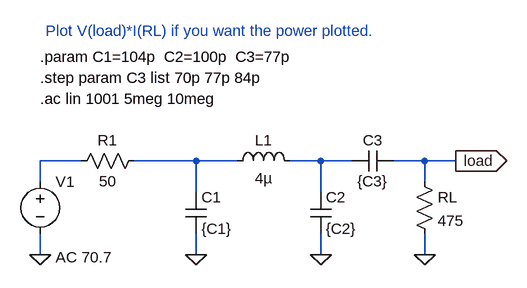
[diagram p0: schematic load_match.asc]
load_match.asc, the LTspice schematic file:
Version 4
SHEET 1 936 680
WIRE 0 112 -64 112
WIRE 176 112 80 112
WIRE 240 112 176 112
WIRE 368 112 320 112
WIRE 416 112 368 112
WIRE 528 112 480 112
WIRE 576 112 528 112
WIRE -64 144 -64 112
WIRE 528 144 528 112
WIRE 176 160 176 112
WIRE 368 160 368 112
WIRE -64 256 -64 224
WIRE 176 256 176 224
WIRE 368 256 368 224
WIRE 528 256 528 224
FLAG 176 256 0
FLAG -64 256 0
FLAG 528 256 0
FLAG 368 256 0
FLAG 576 112 load
IOPIN 576 112 Out
SYMBOL res -16 128 R270
WINDOW 0 32 56 VTop 0
WINDOW 3 0 56 VBottom 0
SYMATTR InstName R1
SYMATTR Value 50
SYMBOL cap 160 160 R0
SYMATTR InstName C1
SYMATTR Value {C1}
SYMBOL ind 224 128 R270
WINDOW 0 32 56 VTop 0
WINDOW 3 5 56 VBottom 0
SYMATTR InstName L1
SYMATTR Value 4µ
SYMBOL cap 416 128 R270
WINDOW 0 32 32 VTop 0
WINDOW 3 0 32 VBottom 0
SYMATTR InstName C3
SYMATTR Value {C3}
SYMBOL cap 352 160 R0
SYMATTR InstName C2
SYMATTR Value {C2}
SYMBOL res 512 128 R0
SYMATTR InstName RL
SYMATTR Value 475
SYMBOL voltage -64 128 R0
WINDOW 123 24 132 Left 0
WINDOW 39 0 0 Left 0
SYMATTR InstName V1
SYMATTR Value ""
SYMATTR Value2 AC 70.7
TEXT -64 16 Left 0 !.ac lin 1001 5meg 10meg
TEXT -56 -88 Left 0 ;Plot V(load)*I(RL) if you want the power plotted.
TEXT -64 -16 Left 0 !.step param C3 list 70p 77p 84p
TEXT -64 -48 Left 0 !.param C1=104p  C2=100p  C3=77p

The netlist it stands for:
* load_match.asc
R1 N001 N002 50
C1 N002 0 {C1}
L1 N002 N003 4µ
C3 N003 load {C3}
C2 N003 0 {C2}
RL load 0 475
V1 N001 0 AC 70.7
.ac lin 1001 5meg 10meg
* Plot V(load)*I(RL) if you want the power plotted.
.step param C3 list 70p 77p 84p
.param C1=104p  C2=100p  C3=77p
.backanno
.end